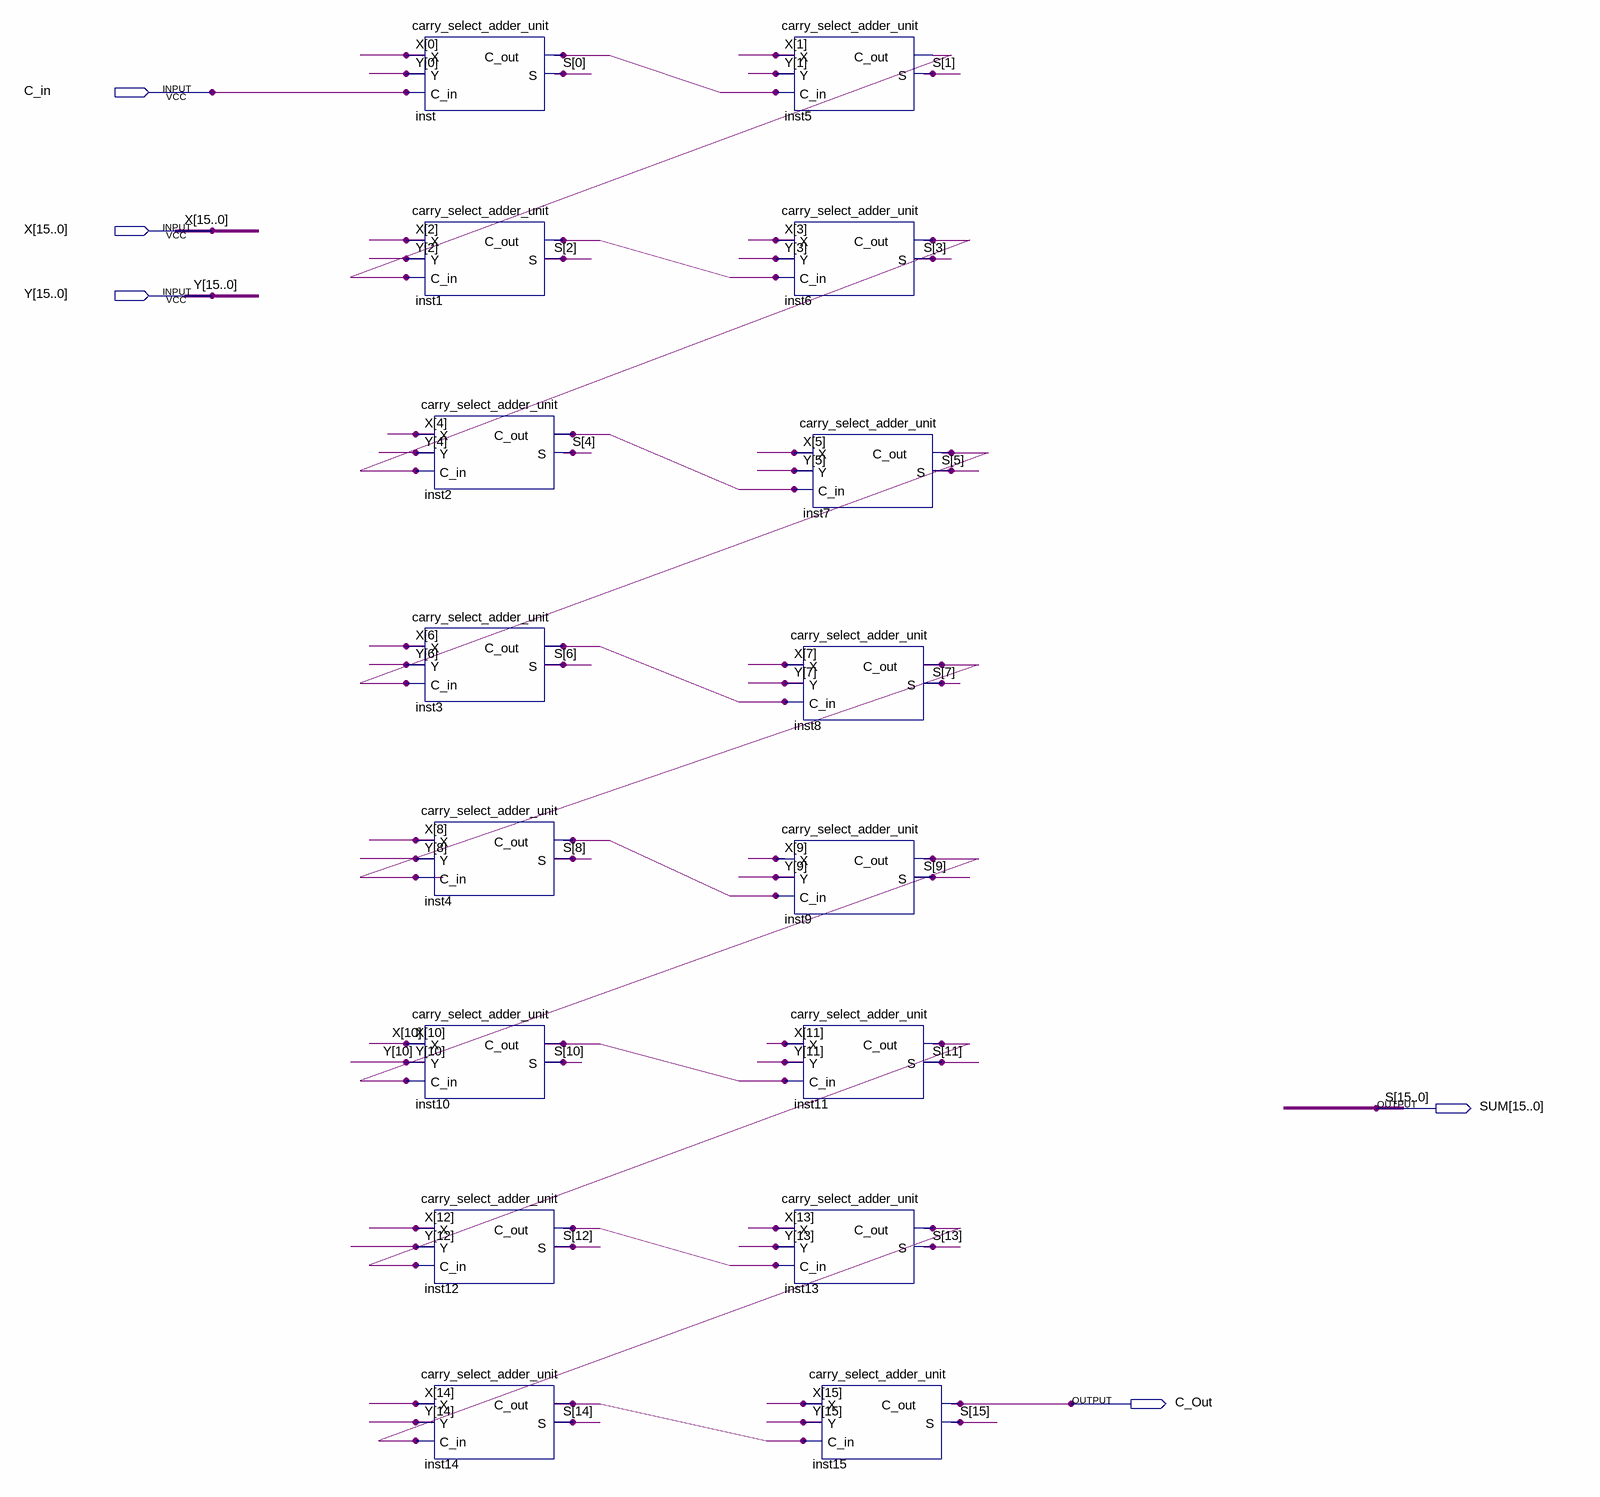
[diagram p0: schematic sheet]
// Quartus schematic carry_select_adder_16.bdf as structural Verilog: 16 symbols, 5 pins
module carry_select_adder_16 (
  input  C_in,
  input  [15:0] X,
  input  [15:0] Y,
  output [15:0] SUM,
  output C_Out
);

  wire inst1_c_out, inst2_c_out, inst3_c_out, inst4_c_out, inst5_c_out, inst6_c_out, inst7_c_out,
       inst8_c_out, inst9_c_out, inst10_c_out, inst11_c_out, inst12_c_out, inst13_c_out, inst14_c_out,
       inst_c_out;

  carry_select_adder_unit inst (.X(X[0]), .Y(Y[0]), .C_in(C_in), .C_out(inst_c_out), .S(SUM[0]));
  carry_select_adder_unit inst1 (.X(X[2]), .Y(Y[2]), .C_in(inst5_c_out), .C_out(inst1_c_out), .S(SUM[2]));
  carry_select_adder_unit inst2 (.X(X[4]), .Y(Y[4]), .C_in(inst6_c_out), .C_out(inst2_c_out), .S(SUM[4]));
  carry_select_adder_unit inst3 (.X(X[6]), .Y(Y[6]), .C_in(inst7_c_out), .C_out(inst3_c_out), .S(SUM[6]));
  carry_select_adder_unit inst4 (.X(X[8]), .Y(Y[8]), .C_in(inst8_c_out), .C_out(inst4_c_out), .S(SUM[8]));
  carry_select_adder_unit inst10 (.X(X[10]), .Y(Y[10]), .C_in(inst9_c_out), .C_out(inst10_c_out), .S(SUM[10]));
  carry_select_adder_unit inst12 (.X(X[12]), .Y(Y[12]), .C_in(inst11_c_out), .C_out(inst12_c_out), .S(SUM[12]));
  carry_select_adder_unit inst14 (.X(X[14]), .Y(Y[14]), .C_in(inst13_c_out), .C_out(inst14_c_out), .S(SUM[14]));
  carry_select_adder_unit inst5 (.X(X[1]), .Y(Y[1]), .C_in(inst_c_out), .C_out(inst5_c_out), .S(SUM[1]));
  carry_select_adder_unit inst6 (.X(X[3]), .Y(Y[3]), .C_in(inst1_c_out), .C_out(inst6_c_out), .S(SUM[3]));
  carry_select_adder_unit inst7 (.X(X[5]), .Y(Y[5]), .C_in(inst2_c_out), .C_out(inst7_c_out), .S(SUM[5]));
  carry_select_adder_unit inst8 (.X(X[7]), .Y(Y[7]), .C_in(inst3_c_out), .C_out(inst8_c_out), .S(SUM[7]));
  carry_select_adder_unit inst9 (.X(X[9]), .Y(Y[9]), .C_in(inst4_c_out), .C_out(inst9_c_out), .S(SUM[9]));
  carry_select_adder_unit inst11 (.X(X[11]), .Y(Y[11]), .C_in(inst10_c_out), .C_out(inst11_c_out), .S(SUM[11]));
  carry_select_adder_unit inst13 (.X(X[13]), .Y(Y[13]), .C_in(inst12_c_out), .C_out(inst13_c_out), .S(SUM[13]));
  carry_select_adder_unit inst15 (.X(X[15]), .Y(Y[15]), .C_in(inst14_c_out), .C_out(C_Out), .S(SUM[15]));

  // Other names for the same wires on the sheet: S[15:0] = SUM
endmodule
